# EAGLE schematic shoeKicking (EAGLE 6.5.0)
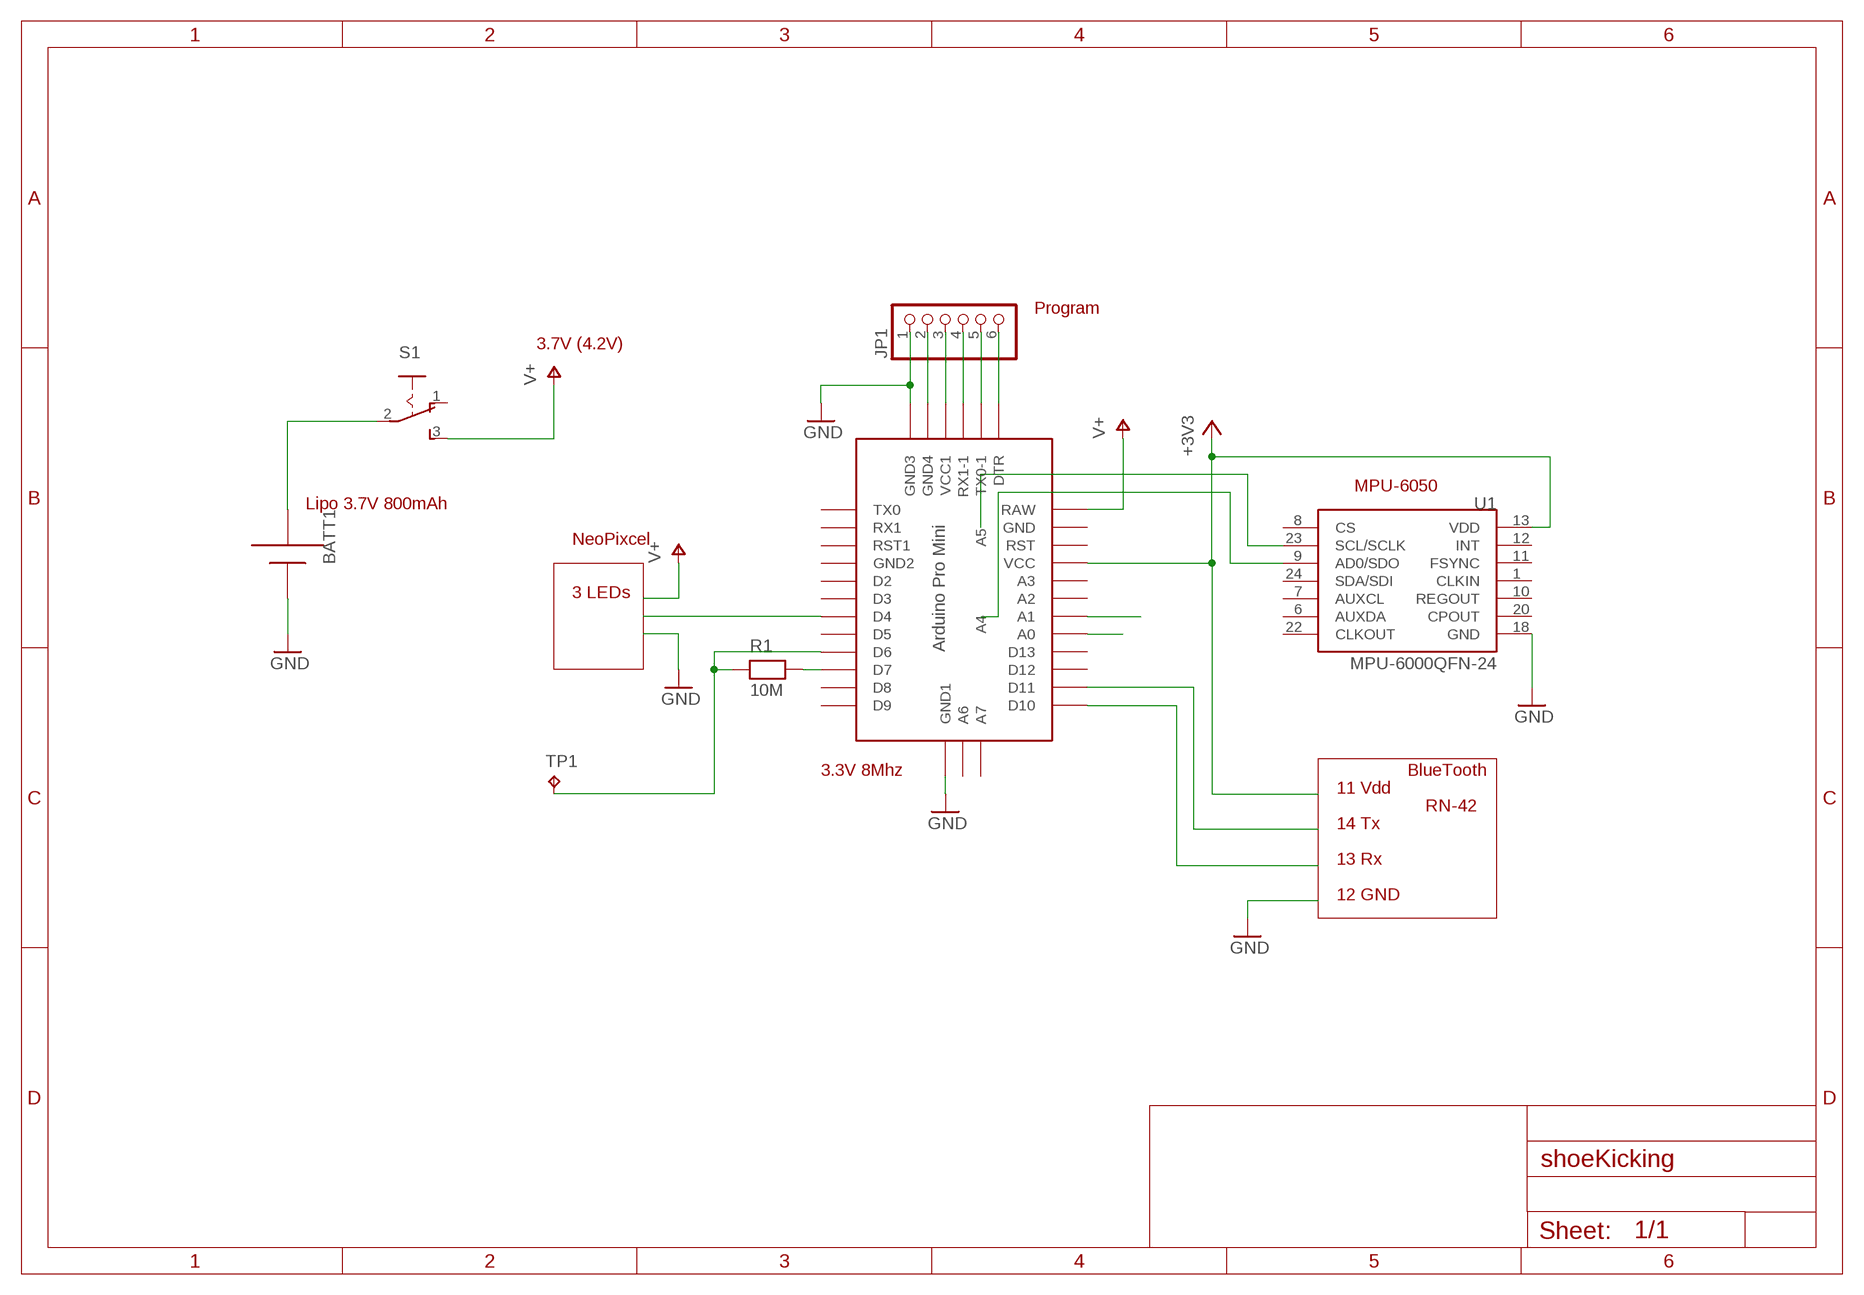
[diagram p0: schematic, sheet 1]

## Parts
BATT1  AAA  [12BH412]
JP1  PINHD-1X6  [1X06]
R1  10M  RESEU-7,5  [R-7,5]
S1  M251  [M251]
TP1  TPB1,27  [B1,27]
U1  MPU-6000QFN-24  [QFN-24-TESTING]
U$1  ABK-PRO-MINI  [ABK-PRO-MINI]

## Nets
+3V3: U1.13(VDD) U$1.VCC
GND: BATT1.+ JP1.1 U1.18(GND) U$1.GND2(GND3) U$1.GND4(GND1)
N$1: U1.23(SCL/SCLK)
N$2: U1.9(AD0/SDO)
N$3: U$1.D4
N$4: U$1.D11
N$5: U$1.D10
N$6: R1.1 TP1.TP U$1.D6
N$7: R1.2 U$1.D7
N$8: BATT1.- S1.2(P)
N$10: JP1.2 U$1.GND3(GND4)
N$11: JP1.3 U$1.VCC1
N$12: JP1.4 U$1.RX1-1
N$13: U$1.A0
N$14: U$1.A1
N$15: JP1.5 U$1.TX0-1
N$16: JP1.6 U$1.DTR
V+: S1.3(S) U$1.RAW
Unconnected: S1.1(O) U1.1(CLKIN) U1.6(AUXDA) U1.7(AUXCL) U1.8(CS) U1.10(REGOUT) U1.11(FSYNC) U1.12(INT) U1.20(CPOUT) U1.22(CLKOUT) U1.24(SDA/SDI) U$1.A2 U$1.A3 U$1.A4 U$1.A5 U$1.A6 U$1.A7 U$1.D2 U$1.D3 U$1.D5 U$1.D8 U$1.D9 U$1.D12 U$1.D13 U$1.GND U$1.GND1(GND2) U$1.RST U$1.RST1 U$1.RX1 U$1.TX0

## Notes on the sheet
- Program
- 3.7V (4.2V)
- MPU-6050
- Lipo 3.7V 800mAh
- NeoPixcel
- 3 LEDs
- 3.3V 8Mhz | BlueTooth
- 11 Vdd
- RN-42
- 14 Tx
- 13 Rx
- 12 GND

## Library data of the parts
BATT1 = adafruit:AAA: AAA PC pin holder Mouser part #12BH412 - but pretty much any 1x AAA battery holder should be the same http://www.ladyada.net/library/pcb/eaglelibrary.html
JP1 = adafruit:PINHD-1X6: PIN HEADER
R1 = discrete4:RESEU-7,5
S1 = switch:M251: SLIDING SWITCH Mors, distributor Buerklin, 11G702
TP1 = testpad:TP: Test pad
U1 = SparkFun-Sensors:MPU-6000: MPU-6000 - I2C address is 0x68 with AD0 low and 0x69 with AD0 high.
U$1 = Arduino-clone:ABK-PRO-MINI: ABK Pro-Mini Arduino Clone